# Altium schematic sheet ESP32C3_BUTTON_LED_MCU_Sheet.SchDoc: ESP32C3_BUTTON_LED
size A4; Author: Hoozz; Organization: Hoozz Play; DocumentNumber: 1; Revision: 1.0; SheetNumber: 1; SheetTotal: 2
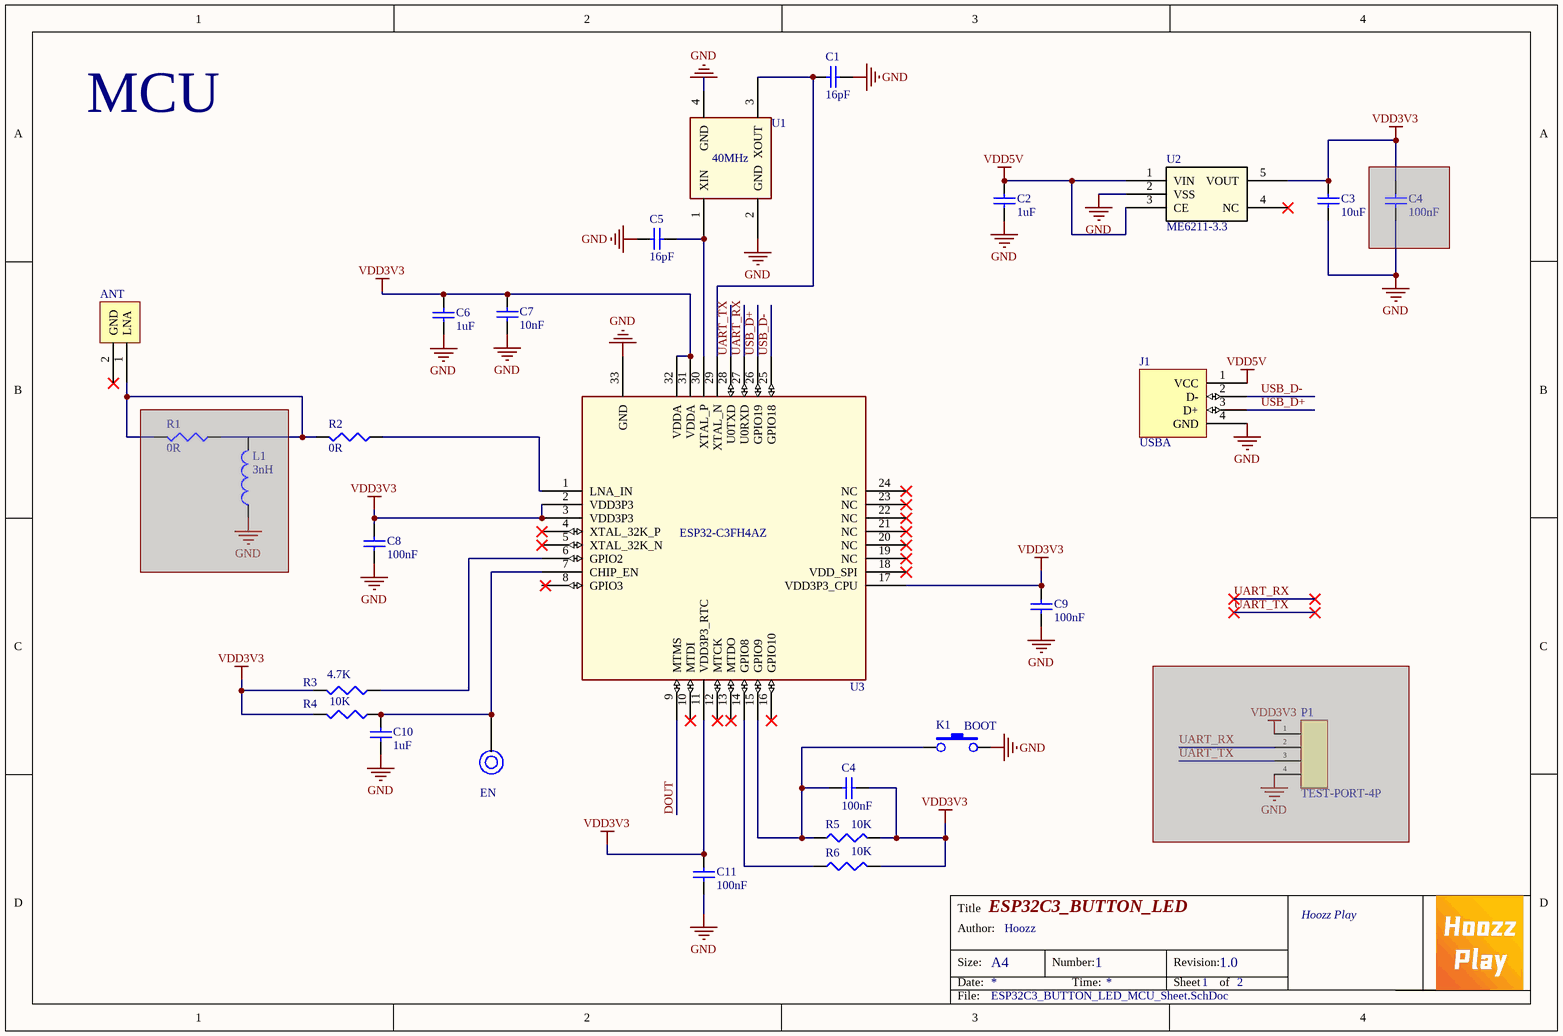
[diagram p0: ESP32C3_BUTTON_LED_MCU_Sheet.SchDoc]

## Parts
(Parts that share a designator on the sheet are numbered #1, #2 ... from top to bottom, then left to right.)
ANT  ANT  [CA-C03]
C1  value 16pF  [0603]  (hidden comment: Cap)
C2  value 1uF  [0603]  (hidden comment: Cap)
C3  value 10uF  [0603]  (hidden comment: Cap)
C4#1  value 100nF  [0603]  (hidden comment: Cap)  (masked out: inside a compile mask, not in the netlist)
C4#2  value 100nF  [0603]  (hidden comment: Cap)
C5  value 16pF  [0603]  (hidden comment: Cap)
C6  value 1uF  [0603]  (hidden comment: Cap)
C7  value 10nF  [0603]  (hidden comment: Cap)
C8  value 100nF  [0603]  (hidden comment: Cap)
C9  value 100nF  [0603]  (hidden comment: Cap)
C10  value 1uF  [0603]  (hidden comment: Cap)
C11  value 100nF  [0603]  (hidden comment: Cap)
EN  TEST-PORT  [TEST-PORT]  (value not drawn)
J1  USBA  [USB-A-2]
K1  BOOT  [TS-C005]
L1  value 3nH  [0603]  (hidden comment: Inductor)  (masked out: inside a compile mask, not in the netlist)
P1  TEST-PORT-4P  [TEST_PORT_4P]  (masked out: inside a compile mask, not in the netlist)
R1  value 0R  [0603]  (hidden comment: Res)  (masked out: inside a compile mask, not in the netlist)
R2  value 0R  [0603]  (hidden comment: Res)
R3  value 4.7K  [0603]  (hidden comment: Res)
R4  value 10K  [0603]  (hidden comment: Res)
R5  value 10K  [0603]  (hidden comment: Res)
R6  value 10K  [0603]  (hidden comment: Res)
U1  40MHz  [3225]
U2  ME6211-3.3  [SOT-23-5]
U3  ESP32-C3FH4AZ  [QFN32_3.7X3.7]

## Nets
GND: C1.2 C2.1 C3.1 C5.1 C6.1 C7.1 C8.1 C9.1 C10.1 C11.1 J1.4(GND) K1.2 U1.2(GND) U1.4(GND) U2.2(VSS) U3.33(GND)
VDD3V3: C3.2 C4#2.1 C6.2 C7.2 C8.2 C9.2 C11.2 R3.2 R4.2 R5.2 R6.2 U2.5(VOUT) U3.2(VDD3P3) U3.3(VDD3P3) U3.11(VDD3P3_RTC) U3.17(VDD3P3_CPU) U3.31(VDDA) U3.32(VDDA)
VDD5V: C2.2 J1.1(VCC) U2.1(VIN) U2.3(CE)
DOUT: U3.9(MTMS)
UART_RX: U3.27(U0RXD)
UART_TX: U3.28(U0TXD)
USB_D+: J1.3(D+) U3.26(GPIO19)
USB_D-: J1.2(D-) U3.25(GPIO18)
NetANT_1: ANT.1(LNA) R2.2
NetC1_1: C1.1 U1.3(XOUT) U3.29(XTAL_N)
NetC4#2_2: C4#2.2 K1.1 R5.1 U3.15(GPIO9)
NetC5_2: C5.2 U1.1(XIN) U3.30(XTAL_P)
NetC10_2: C10.2 EN.T R4.1 U3.7(CHIP_EN)
NetR2_1: R2.1 U3.1(LNA_IN)
NetR3_1: R3.1 U3.6(GPIO2)
NetR6_1: R6.1 U3.14(GPIO8)

Not connected (* = marked no-connect by the designer): ANT 2(GND)*; U2 4(NC)*; U3 4(XTAL_32K_P)* 5(XTAL_32K_N)* 8(GPIO3) 10(MTDI)* 12(MTCK)* 13(MTDO)* 16(GPIO10)* 18(VDD_SPI)* 19(NC)* 20(NC)* 21(NC)* 22(NC)* 23(NC)* 24(NC)*

## Notes on the sheet
- MCU
- Title
- Size:
- Date:
- Author:
- A4
- Number:
- Time:
- Revision:
- Sheet
- of
- File:

## Library data of the parts
C1-C3 C4#1 C4#2 C5-C11 = Cap: Capacitor; Published: 8-Jun-2000; LatestRevisionDate: 17-Jul-2002; LatestRevisionNote: Re-released for DXP Platform.; PackageReference: RAD-0.3; Publisher: Altium Limited; PackageDescription: Radial Cap, Thru-Hole; 2 Leads; 0.3 in Pin Spacing
J1 = USBA: USB2.0
K1 = BUTTON
L1 = Inductor: Code_IEC: 1005; Published: 8-Jun-2000; LatestRevisionDate: 29-May-2009; LatestRevisionNote: IPC-7351 Footprint Added.; PackageReference: 0402-A; Publisher: Altium Limited; PackageDescription: Chip Inductor; Code_JEITA: 0402
R1-R6 = Res: Resistor; Published: 8-Jun-2000; LatestRevisionDate: 29-May-2009; LatestRevisionNote: IPC-7351 Footprint Added.; PackageReference: J1-0603; Publisher: Altium Limited; PackageDescription: Chip Resistor
U1 = XTAL2
U2 = ME6211-3.3: No Description Available; Manufacturer: Texas Instruments; Manufacturer_Part_Number: REG102NA-2.5/250; Built_By: EMA_UL_Team; SourceLibrary: TI_2016-07-06; Vendor: Texas Instruments; Copyright: Copyright (C) 2018 Accelerated Designs. All rights reserved; RefDes: RefDes; Type: DEV